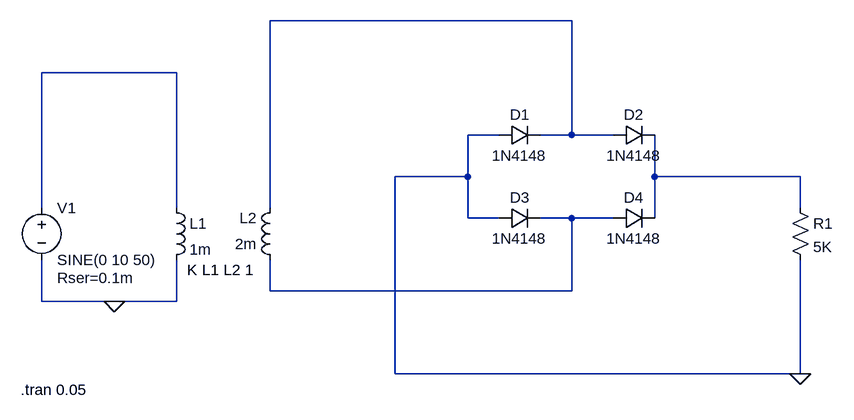
[diagram p0: schematic full_wave_rectifier.asc]
full_wave_rectifier.asc, the LTspice schematic file:
Version 4.1
SHEET 1 880 680
WIRE 288 -48 -176 -48
WIRE -320 32 -528 32
WIRE 176 128 128 128
WIRE 288 128 288 -48
WIRE 288 128 240 128
WIRE 352 128 288 128
WIRE 128 192 128 128
WIRE 128 192 16 192
WIRE 416 192 416 128
WIRE 640 192 416 192
WIRE -528 240 -528 32
WIRE -320 240 -320 32
WIRE -176 240 -176 -48
WIRE 640 240 640 192
WIRE 128 256 128 192
WIRE 176 256 128 256
WIRE 288 256 240 256
WIRE 352 256 288 256
WIRE 416 256 416 192
WIRE -176 368 -176 320
WIRE 288 368 288 256
WIRE 288 368 -176 368
WIRE -528 384 -528 320
WIRE -416 384 -528 384
WIRE -320 384 -320 320
WIRE -320 384 -416 384
WIRE 16 496 16 192
WIRE 640 496 640 320
WIRE 640 496 16 496
FLAG -416 384 0
FLAG 640 496 0
SYMBOL diode 176 144 R270
WINDOW 0 32 32 VTop 2
WINDOW 3 0 32 VBottom 2
SYMATTR InstName D1
SYMATTR Value 1N4148
SYMBOL diode 352 144 R270
WINDOW 0 32 32 VTop 2
WINDOW 3 0 32 VBottom 2
SYMATTR InstName D2
SYMATTR Value 1N4148
SYMBOL diode 176 272 R270
WINDOW 0 32 32 VTop 2
WINDOW 3 0 32 VBottom 2
SYMATTR InstName D3
SYMATTR Value 1N4148
SYMBOL diode 352 272 R270
WINDOW 0 32 32 VTop 2
WINDOW 3 0 32 VBottom 2
SYMATTR InstName D4
SYMATTR Value 1N4148
SYMBOL ind -336 224 R0
SYMATTR InstName L1
SYMATTR Value 1m
SYMATTR Type ind
SYMATTR SpiceLine Rser=1m
SYMBOL ind -160 336 R180
WINDOW 0 36 80 Left 2
WINDOW 3 36 40 Left 2
SYMATTR InstName L2
SYMATTR Value 2m
SYMATTR Type ind
SYMATTR SpiceLine Rser=1m
SYMBOL voltage -528 224 R0
WINDOW 123 0 0 Left 0
WINDOW 39 24 124 Left 2
SYMATTR SpiceLine Rser=0.1m
SYMATTR InstName V1
SYMATTR Value SINE(0 10 50)
SYMBOL res 624 224 R0
SYMATTR InstName R1
SYMATTR Value 5K
TEXT -304 336 Left 2 !K L1 L2 1
TEXT -560 520 Left 2 !.tran 0.05

The netlist it stands for:
* full_wave_rectifier.asc
D1 0 N001 1N4148
D2 N001 N003 1N4148
D3 0 N004 1N4148
D4 N004 N003 1N4148
L1 N002 0 1m Rser=1m
L2 N004 N001 2m Rser=1m
V1 N002 0 SINE(0 10 50) Rser=0.1m
R1 N003 0 5K
.model D D
.lib standard.dio
K L1 L2 1
.tran 0.05
.backanno
.end